# EAGLE schematic Esquematico_ppg (EAGLE 9.6.2)
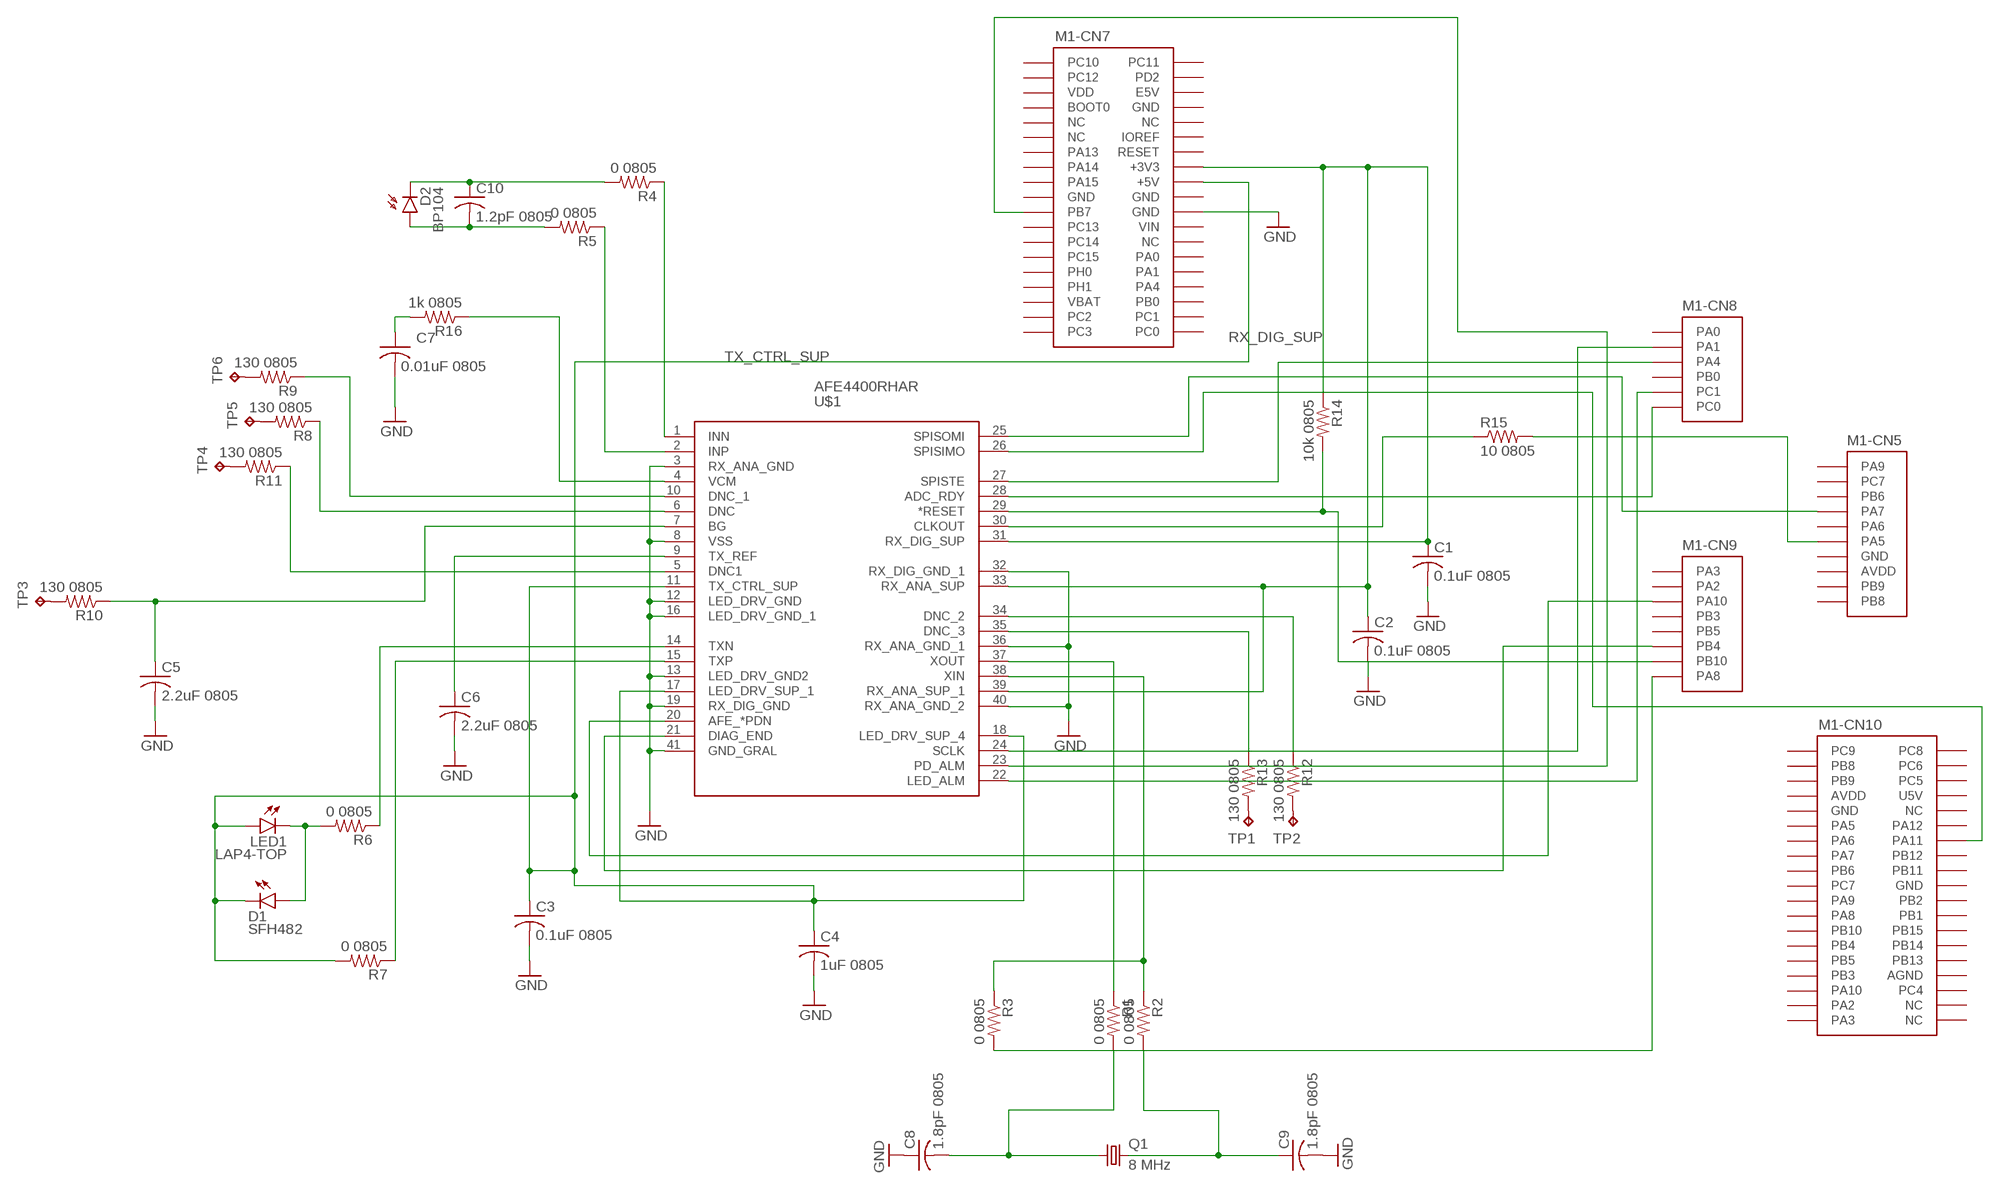
[diagram p0: schematic, sheet 1]

## Parts
C1  0.1uF 0805  C-USC0805  [C0805]
C2  0.1uF 0805  C-USC0805  [C0805]
C3  0.1uF 0805  C-USC0805  [C0805]
C4  1uF 0805  C-USC0805  [C0805]
C5  2.2uF 0805  C-USC0805  [C0805]
C6  2.2uF 0805  C-USC0805  [C0805]
C7  0.01uF 0805  C-USC0805  [C0805]
C8  1.8pF 0805  C-USC0805  [C0805]
C9  1.8pF 0805  C-USC0805  [C0805]
C10  1.2pF 0805  C-USC0805  [C0805]
D1  SFH482  [SFH482]
D2  BP104  [BP104]
LED1  LAP4-TOP  [P47F-TOP]
M1  NUCLEO-L452RE  [NUCLEO-64]
Q1  8 MHz  CRYSTALSM49  [SM49]
R1  0 0805  R-US_M0805  [M0805]
R2  0 0805  R-US_M0805  [M0805]
R3  0 0805  R-US_M0805  [M0805]
R4  0 0805  R-US_M0805  [M0805]
R5  0 0805  R-US_M0805  [M0805]
R6  0 0805  R-US_M0805  [M0805]
R7  0 0805  R-US_M0805  [M0805]
R8  130 0805  R-US_M0805  [M0805]
R9  130 0805  R-US_M0805  [M0805]
R10  130 0805  R-US_M0805  [M0805]
R11  130 0805  R-US_M0805  [M0805]
R12  130 0805  R-US_M0805  [M0805]
R13  130 0805  R-US_M0805  [M0805]
R14  10k 0805  R-US_M0805  [M0805]
R15  10 0805  R-US_M0805  [M0805]
R16  1k 0805  R-US_M0805  [M0805]
TP1  TPB1,27  [B1,27]
TP2  TPB1,27  [B1,27]
TP3  TPB1,27  [B1,27]
TP4  TPB1,27  [B1,27]
TP5  TPB1,27  [B1,27]
TP6  TPB1,27  [B1,27]
U$1  AFE4400RHAR  AFE4400  [40-VQFN(6X6)]

## Nets
GND: C1.2 C2.2 C3.2 C4.2 C5.2 C6.2 C7.2 C8.1 C9.2 M1.CN7-22(-CN7:GND) U$1.3(RX_ANA_GND) U$1.8(VSS) U$1.12(LED_DRV_GND) U$1.13(LED_DRV_GND2) U$1.16(LED_DRV_GND_1) U$1.19(RX_DIG_GND) U$1.32(RX_DIG_GND_1) U$1.36(RX_ANA_GND_1) U$1.40(RX_ANA_GND_2) U$1.41(GND_GRAL)
N$1: R4.1 U$1.1(INN)
N$2: R5.1 U$1.2(INP)
N$3: R6.1 U$1.14(TXN)
N$4: R7.1 U$1.15(TXP)
N$5: R2.1 R3.1 U$1.38(XIN)
N$6: R1.1 U$1.37(XOUT)
N$7: R13.2 TP1.TP
N$8: R12.2 TP2.TP
N$9: R10.2 TP3.TP
N$10: R11.1 U$1.5(DNC1)
N$11: R12.1 U$1.34(DNC_2)
N$12: R11.2 TP4.TP
N$13: R9.1 U$1.10(DNC_1)
N$14: R8.1 U$1.6(DNC)
N$15: C5.1 R10.1 U$1.7(BG)
N$16: R13.1 U$1.35(DNC_3)
N$17: M1.CN9-7(-CN9:PB10) R14.2 U$1.29(*RESET)
N$18: R8.2 TP5.TP
N$19: R15.1 U$1.30(CLKOUT)
N$20: M1.CN5-6(-CN5:PA5) R15.2
N$21: M1.CN9-8(-CN9:PA8) R3.2
N$22: M1.CN8-3(-CN8:PA4) U$1.27(SPISTE)
N$23: C6.1 U$1.9(TX_REF)
N$24: M1.CN10-14(-CN10:PA11) U$1.26(SPISIMO)
N$25: R16.1 U$1.4(VCM)
N$26: C7.1 R16.2
N$27: C8.2 Q1.1 R1.2
N$28: C9.1 Q1.2 R2.2
N$29: M1.CN5-4(-CN5:PA7) U$1.25(SPISOMI)
N$30: M1.CN7-21(-CN7:PB7) U$1.23(PD_ALM)
N$31: M1.CN8-5(-CN8:PC1) U$1.22(LED_ALM)
N$32: M1.CN8-6(-CN8:PC0) U$1.28(ADC_RDY)
N$33: M1.CN9-3(-CN9:PA10) U$1.20(AFE_*PDN)
N$34: M1.CN9-6(-CN9:PB4) U$1.21(DIAG_END)
N$35: D1.A LED1.C R6.2
N$36: R9.2 TP6.TP
N$37: C10.2 D2.A R5.2
N$38: C10.1 D2.K(C) R4.2
RX_DIG_SUP: C1.1 C2.1 M1.CN7-16(-CN7:+3V3) R14.1 U$1.31(RX_DIG_SUP) U$1.33(RX_ANA_SUP) U$1.39(RX_ANA_SUP_1)
SCLK: M1.CN8-2(-CN8:PA1) U$1.24(SCLK)
TX_CTRL_SUP: C3.1 C4.1 D1.K(C) LED1.A M1.CN7-18(-CN7:+5V) R7.2 U$1.11(TX_CTRL_SUP) U$1.17(LED_DRV_SUP_1) U$1.18(LED_DRV_SUP_4)
Unconnected: M1.CN5-1(-CN5:PA9) M1.CN5-2(-CN5:PC7) M1.CN5-3(-CN5:PB6) M1.CN5-5(-CN5:PA6) M1.CN5-9(-CN5:PB9) M1.CN5-10(-CN5:PB8) M1.CN6-1(-CN6:NC) M1.CN6-3(-CN6:RESET) M1.CN7-1(-CN7:PC10) M1.CN7-2(-CN7:PC11) M1.CN7-3(-CN7:PC12) M1.CN7-4(-CN7:PD2) M1.CN7-6(-CN7:E5V) M1.CN7-7(-CN7:BOOT0) M1.CN7-9(-CN7:NC) M1.CN7-10(-CN7:NC) M1.CN7-11(-CN7:NC) M1.CN7-12(-CN7:IOREF) M1.CN7-13(-CN7:PA13) M1.CN7-14(-CN7:RESET) M1.CN7-15(-CN7:PA14) M1.CN7-17(-CN7:PA15) M1.CN7-23(-CN7:PC13) M1.CN7-25(-CN7:PC14) M1.CN7-26(-CN7:NC) M1.CN7-27(-CN7:PC15) M1.CN7-28(-CN7:PA0) M1.CN7-29(-CN7:PH0) M1.CN7-30(-CN7:PA1) M1.CN7-31(-CN7:PH1) M1.CN7-32(-CN7:PA4) M1.CN7-34(-CN7:PB0) M1.CN7-35(-CN7:PC2) M1.CN7-36(-CN7:PC1) M1.CN7-37(-CN7:PC3) M1.CN7-38(-CN7:PC0) M1.CN8-1(-CN8:PA0) M1.CN8-4(-CN8:PB0) M1.CN9-1(-CN9:PA3) M1.CN9-2(-CN9:PA2) M1.CN9-4(-CN9:PB3) M1.CN9-5(-CN9:PB5) M1.CN10-1(-CN10:PC9) M1.CN10-2(-CN10:PC8) M1.CN10-3(-CN10:PB8) M1.CN10-4(-CN10:PC6) M1.CN10-5(-CN10:PB9) M1.CN10-6(-CN10:PC5) M1.CN10-10(-CN10:NC) M1.CN10-11(-CN10:PA5) M1.CN10-12(-CN10:PA12) M1.CN10-13(-CN10:PA6) M1.CN10-15(-CN10:PA7) M1.CN10-16(-CN10:PB12) M1.CN10-17(-CN10:PB6) M1.CN10-18(-CN10:PB11) M1.CN10-19(-CN10:PC7) M1.CN10-21(-CN10:PA9) M1.CN10-22(-CN10:PB2) M1.CN10-23(-CN10:PA8) M1.CN10-24(-CN10:PB1) M1.CN10-25(-CN10:PB10) M1.CN10-26(-CN10:PB15) M1.CN10-27(-CN10:PB4) M1.CN10-28(-CN10:PB14) M1.CN10-29(-CN10:PB5) M1.CN10-30(-CN10:PB13) M1.CN10-31(-CN10:PB3) M1.CN10-33(-CN10:PA10) M1.CN10-34(-CN10:PC4) M1.CN10-35(-CN10:PA2) M1.CN10-36(-CN10:NC) M1.CN10-37(-CN10:PA3) M1.CN10-38(-CN10:NC)

## Power pins joined to a net without a drawn wire
+3V3: M1.CN6-4(-CN6:+3V3)
+5V: M1.CN6-5(-CN6:+5V)
AGND: M1.CN10-32(-CN10:AGND)
AVDD: M1.CN5-8(-CN5:AVDD) M1.CN10-7(-CN10:AVDD)
GND: M1.CN5-7(-CN5:GND) M1.CN6-6(-CN6:GND) M1.CN6-7(-CN6:GND) M1.CN7-8(-CN7:GND) M1.CN7-19(-CN7:GND) M1.CN7-20(-CN7:GND) M1.CN10-9(-CN10:GND) M1.CN10-20(-CN10:GND)
IOREF: M1.CN6-2(-CN6:IOREF)
U5V: M1.CN10-8(-CN10:U5V)
VBAT: M1.CN7-33(-CN7:VBAT)
VDD: M1.CN7-5(-CN7:VDD)
VIN: M1.CN6-8(-CN6:VIN) M1.CN7-24(-CN7:VIN)

## Library data of the parts
C1-C4 = rcl:C-US: CAPACITOR, American symbol; PARTNO: GRM188R72A104KA35J; SPICEPREFIX: C
C5 C6 = rcl:C-US: CAPACITOR, American symbol; PARTNO: GRM21BR71E225KE11L; SPICEPREFIX: C
C7 = rcl:C-US: CAPACITOR, American symbol; PARTNO: GRM2195C1H103JA01D; SPICEPREFIX: C
C8 C9 = rcl:C-US: CAPACITOR, American symbol; PARTNO: 600F180FT250XT; SPICEPREFIX: C
C10 = rcl:C-US: CAPACITOR, American symbol; PARTNO: GQM2195C2E1R2BB12D; SPICEPREFIX: C
D1 = led:SFH482: IR LED infrared emitting diode, Infineon; PARTNO: SCM-013RT
D2 = opto-trans-siemens:BP104: PHOTO DIODE; MF: VISHAY/TELEFUNKEN; MPN: BP104; OC_FARNELL: 1779636; OC_NEWARK: 14M4504; PARTNO: VEMD2020X01
LED1 = led:*P4: PointLED® Enhanced Thinfilm LED TOP & BOTTOM mount LS P47F, LR P47F, LA P47F, LY P47F, LT P4SG, LB P4SG, LW P4SG Source: http://catalog.osram-os.com .. LA_LR_LS_LY_P47F_Pb_free.pdf; PARTNO: HLMP-K150
M1 = NUCLEO-L452RE:NUCLEO-L452RE: No existe un outline (Layer Dimension) para esta librería. En su lugar se utilizó una referencia en tDocu. Al momento de diseñar la tarjeta, el Dimension debe ser dibujado según los requerimientos del usuario, o simplemente copiar los contenidos del tDocu en Dimensions.
Q1 = crystal:CRYSTAL: CRYSTAL; OC_FARNELL: unknown; OC_NEWARK: unknown; PARTNO: ABLS-8.000MHZ-B4-T
R1-R7 = rcl:R-US_: RESISTOR, American symbol; PARTNO: RMCF0805ZT0R00; SPICEPREFIX: R
R8-R13 = rcl:R-US_: RESISTOR, American symbol; PARTNO: RMCF0805FT130R; SPICEPREFIX: R
R14 = rcl:R-US_: RESISTOR, American symbol; PARTNO: RC0805FR-1010KL; SPICEPREFIX: R
R15 = rcl:R-US_: RESISTOR, American symbol; PARTNO: RC0805FR-0710RL; SPICEPREFIX: R
R16 = rcl:R-US_: RESISTOR, American symbol; PARTNO: RMCF0805FT1K00; SPICEPREFIX: R
TP1-TP6 = testpad:TP: Test pad
U$1 = AFE4400RHAR - TI:AFE4400